# EAGLE design avr_isp_adapter (EAGLE 6.2)
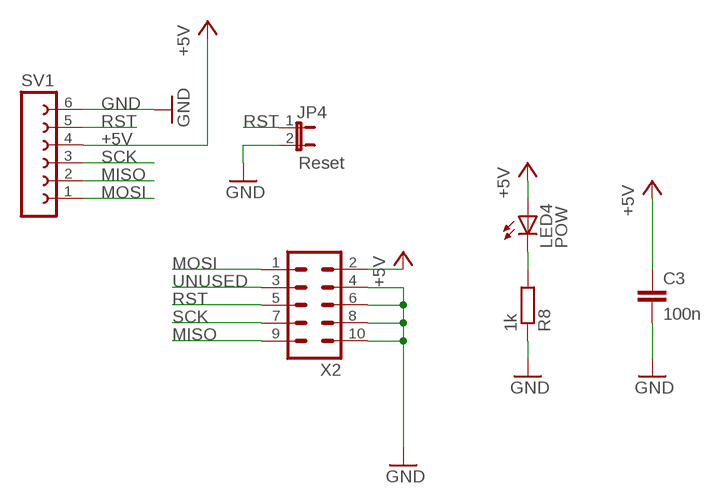
[diagram p0: schematic, sheet 1]

## Parts
C3  100n  C-EU050-025X075  [C050-025X075]
JP4  Reset  JP1E  [JP1]
LED4  POW  LED5MM  [LED5MM]
R8  1k  R-EU_0204/5  [0204/5]
SV1  FE06W  [FE06W]
X2  ML10L  [ML10L]

## Nets
+5V: C3.1 LED4.A SV1.4 X2.2
GND: C3.2 JP4.2 R8.1 SV1.6 X2.4 X2.6 X2.8 X2.10
MISO: SV1.2 X2.9
MOSI: SV1.1 X2.1
N$1: LED4.K(C) R8.2
RST: JP4.1 SV1.5 X2.5
SCK: SV1.3 X2.7
UNUSED: X2.3

## Library data of the parts
C3 = rcl:C-EU: CAPACITOR, European symbol
JP4 = jumper:JP1E: JUMPER
LED4 = led:LED: LED OSRAM: - CHIPLED LG R971, LG N971, LY N971, LG Q971, LY Q971, LO R971, LY R971 LH N974, LH R974 LS Q976, LO Q976, LY Q976 LO Q996 - Hyper CHIPLED LW Q18S LB Q993, LB Q99A, LB R99A - SideLED LS A670, LO A670, LY A670, LG A670, LP A670 LB A673, LV A673, LT A673, LW A673 LH A674 LY A675 LS A676, LA A676, LO A676, LY A676, LW A676 LS A679, LY A679, LG A679 - Hyper Micro SIDELED® LS Y876, LA Y876, LO Y876, LY Y876 LT Y87S - SmartLED LW L88C, LW L88S LB L89C, LB L89S, LG L890 LS L89K, LO L89K, LY L89K LS L896, LA L896, LO L896, LY L896 - TOPLED LS T670, LO T670, LY T670, LG T670, LP T670 LSG T670, LSP T670, LSY T670, LOP T670, LYG T670 LG T671, LOG T671, LSG T671 LB T673, LV T673, LT T673, LW T673 LH T674 LS T676, LA T676, LO T676, LY T676, LB T676, LH T676, LSB T676, LW T676 LB T67C, LV T67C, LT T67C, LS T67K, LO T67K, LY T67K, LW E67C LS E67B, LA E67B, LO E67B, LY E67B, LB E67C, LV E67C, LT E67C LW T67C LS T679, LY T679, LG T679 LS T770, LO T770, LY T770, LG T770, LP T770 LB T773, LV T773, LT T773, LW T773 LH T774 LS E675, LA E675, LY E675, LS T675 LS T776, LA T776, LO T776, LY T776, LB T776 LHGB T686 LT T68C, LB T68C - Hyper Mini TOPLED® LB M676 - Mini TOPLED Santana® LG M470 LS M47K, LO M47K, LY M47K Source: http://www.osram.convergy.de LUXEON: - LUMILED® LXK2-PW12-R00, LXK2-PW12-S00, LXK2-PW14-U00, LXK2-PW14-V00 LXK2-PM12-R00, LXK2-PM12-S00, LXK2-PM14-U00 LXK2-PE12-Q00, LXK2-PE12-R00, LXK2-PE12-S00, LXK2-PE14-T00, LXK2-PE14-U00 LXK2-PB12-K00, LXK2-PB12-L00, LXK2-PB12-M00, LXK2-PB14-N00, LXK2-PB14-P00, LXK2-PB14-Q00 LXK2-PR12-L00, LXK2-PR12-M00, LXK2-PR14-Q00, LXK2-PR14-R00 LXK2-PD12-Q00, LXK2-PD12-R00, LXK2-PD12-S00 LXK2-PH12-R00, LXK2-PH12-S00 LXK2-PL12-P00, LXK2-PL12-Q00, LXK2-PL12-R00 Source: www.luxeon.com KINGBRIGHT: KA-3528ASYC Source: www.kingbright.com
R8 = rcl:R-EU_: RESISTOR, European symbol
SV1 = con-lsta:FE06W: FEMALE HEADER; OC_FARNELL: unknown; OC_NEWARK: unknown
X2 = con-harting-ml:ML10: HARTING

## Board
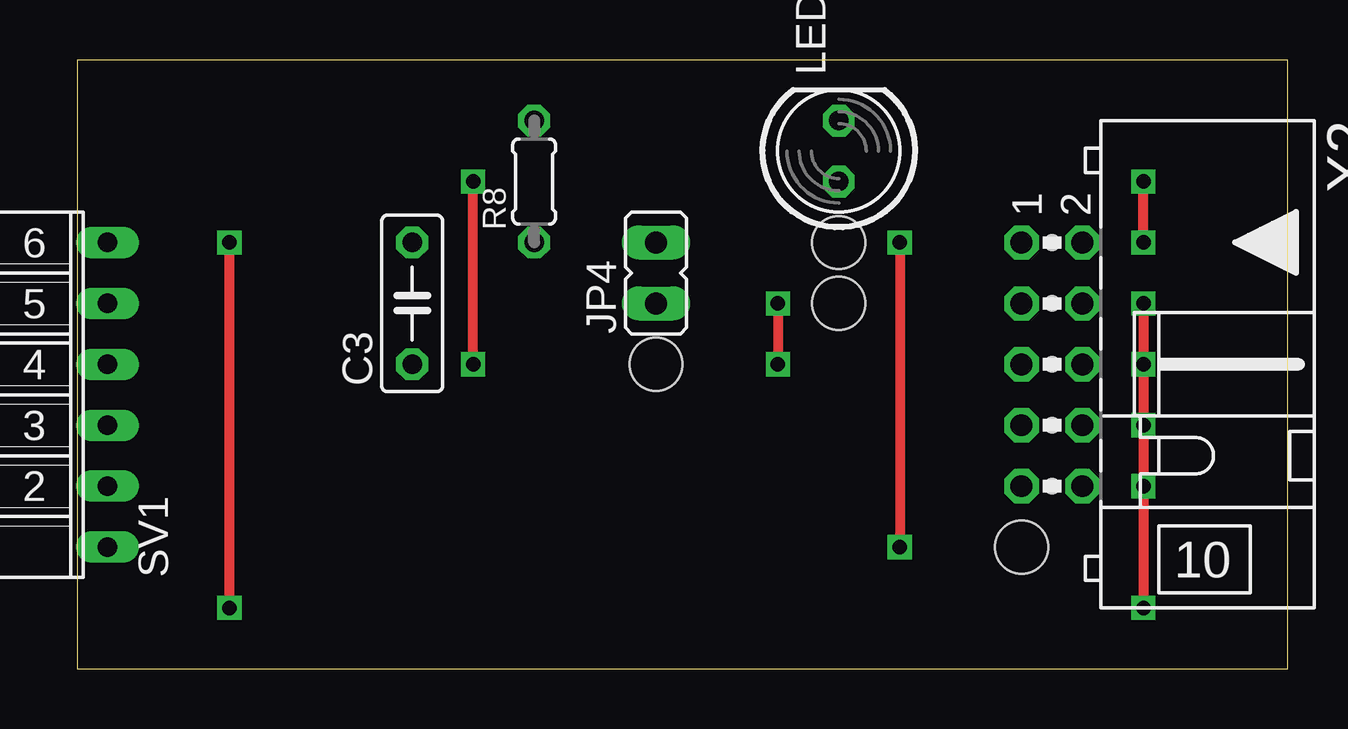
[diagram p1: board, top side]
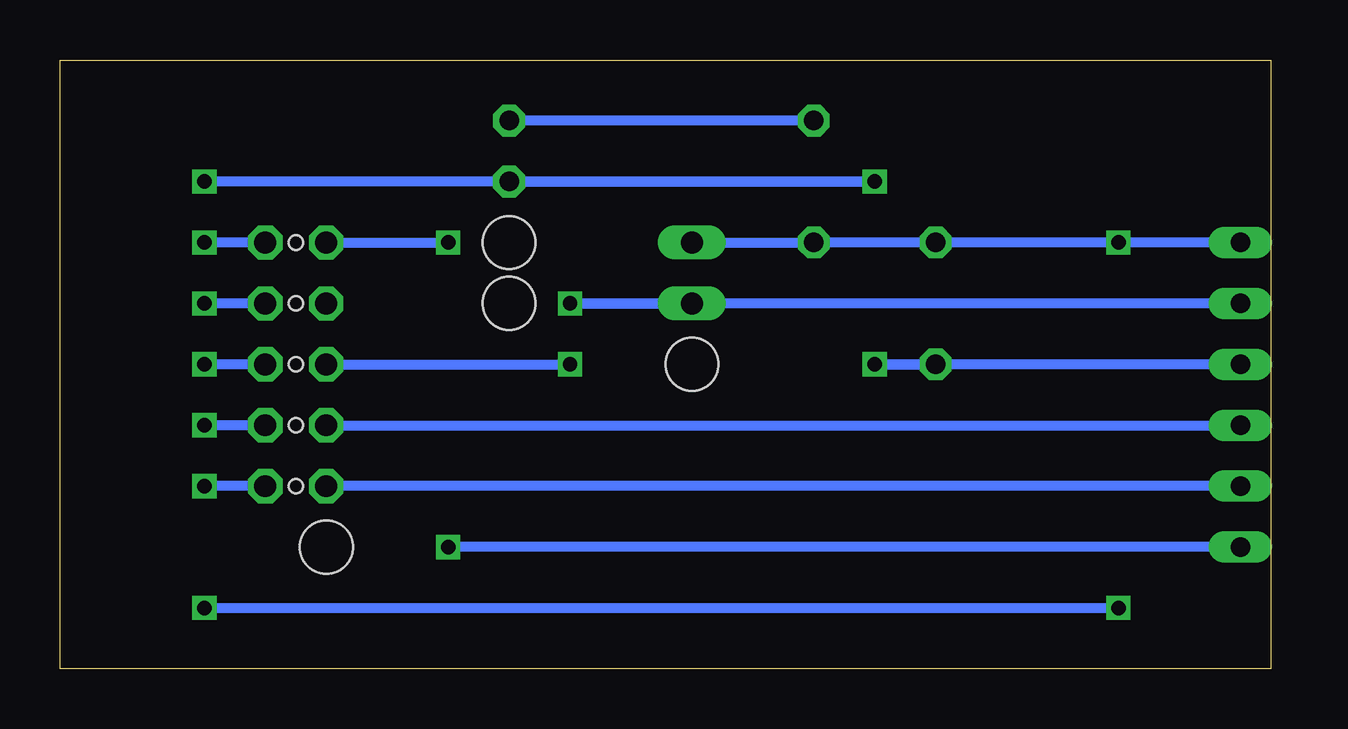
[diagram p2: board, bottom side, seen from below]

Size 50.47 x 25.39 mm. Coordinates in mm from the lower left corner, seen from the top.
Outline: 0,0 50.47,0 50.47,25.39 0,25.39 0,0
Copper layers (1*16): Top 0.035mm / dielectric 1.5mm / Bottom 0.035mm
Design rules: minimum track width 10mil, minimum drill 24mil, track to track 8mil, track to pad 8mil, pad to pad 8mil, via to via 8mil, smd to smd 8mil, copper to edge 40mil, drill to drill 8mil, minimum pad ring 10mil, minimum via ring 8mil, stop-mask expansion 4mil, vias tented up to drill 0mil, thermal gap 10mil
Holes 0.6 mm at 40.64,17.78 40.64,15.24 40.64,12.7 40.64,10.16 40.64,7.62
Holes 2.2 mm at 24.13,12.7 31.75,15.24 31.75,17.78 39.37,5.08

### Footprints (pad centres in the part's own frame; a part is rotated, then mirrored left to right if it is on the bottom)
C050-025X075 = drill 0.813 octagon: 1 -2.54,0; 2 2.54,0
JP1 = drill 0.914 long: 1 0,-1.27; 2 0,1.27
LED5MM = drill 0.813 octagon: A -1.27,0; K 1.27,0
0204/5 = drill 0.813 octagon: 1 -2.54,0; 2 2.54,0
FE06W = drill 0.813 long: 1 -6.35,0; 2 -3.81,0; 3 -1.27,0; 4 1.27,0; 5 3.81,0; 6 6.35,0
ML10L = drill 0.914 octagon: 1 -5.08,-1.27; 2 -5.08,1.27; 3 -2.54,-1.27; 4 -2.54,1.27; 5 0,-1.27; 6 0,1.27; 7 2.54,-1.27; 8 2.54,1.27; 9 5.08,-1.27; 10 5.08,1.27

### Placement (x,y rotation side)
C3  13.97,15.24 90 top
JP4  24.13,16.51 0 top
LED4  31.75,21.59 90 top
R8  19.05,20.32 90 top
SV1  1.27,11.43 90 top
X2  40.64,12.7 270 top

### Tracks (layer width: path | path; a pad name or v marks a point on that pad's centre or on a via)
+5V  (via drill 0.6)
  Top 0.406: v16.51,12.7 v16.51,20.32 | v44.45,17.78 v44.45,20.32
  Bottom 0.406: SV1.4 v16.51,12.7 C3.1 | X2.2 v44.45,17.78 | v44.45,20.32 v16.51,20.32 LED4.A
GND  (via drill 0.6)
  Top 0.406: v6.35,17.78 v6.35,2.54 | v44.45,2.54 v44.45,7.62 v44.45,10.16 v44.45,12.7 v44.45,15.24
  Bottom 0.406: SV1.6 v6.35,17.78 | X2.10 v44.45,7.62 | X2.8 v44.45,10.16 | X2.6 v44.45,12.7 | X2.4 v44.45,15.24 | v44.45,2.54 v6.35,2.54 | v6.35,17.78 C3.2 | v6.35,17.78 R8.1 JP4.2
MISO
  Bottom 0.406: SV1.2 X2.9
MOSI  (via drill 0.6)
  Top 0.406: v34.29,17.78 v34.29,5.08
  Bottom 0.406: SV1.1 v34.29,5.08 | X2.1 v34.29,17.78
N$1
  Bottom 0.406: R8.2 LED4.K
RST  (via drill 0.6)
  Top 0.406: v29.21,15.24 v29.21,12.7
  Bottom 0.406: SV1.5 v29.21,15.24 JP4.1 | X2.5 v29.21,12.7
SCK
  Bottom 0.406: X2.7 SV1.3

### Text on the board
Document: GND | MOSI | RST | RST | VCC | SCK | SCK | MISO | MISO | MOSI | MOSI